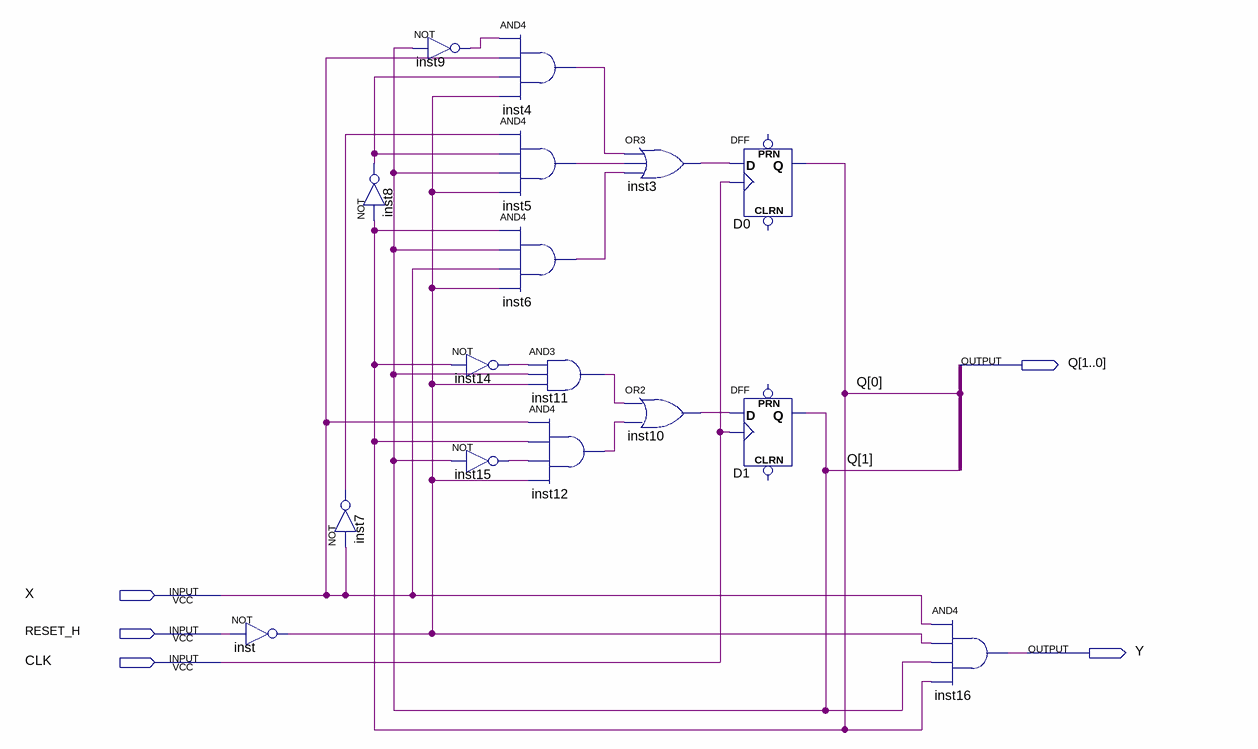
[diagram p0: schematic sheet]
// Quartus schematic MEF.bdf as structural Verilog: 16 symbols, 5 pins
module MEF (
  input  X,
  input  RESET_H,
  input  CLK,
  output [1:0] Q,
  output Y
);

  wire inst3_out, inst4_out, inst5_out, inst6_out, inst7_out, inst8_out, inst9_out, inst10_out, inst11_out,
       inst12_out, inst14_out, inst15_out, inst_out;

  not inst (inst_out, RESET_H);
  not inst8 (inst8_out, Q[0]);
  not inst7 (inst7_out, X);
  not inst9 (inst9_out, Q[1]);
  and inst4 (inst4_out, inst9_out, X, inst8_out, inst_out);
  and inst5 (inst5_out, inst7_out, inst8_out, Q[1], inst_out);
  and inst6 (inst6_out, Q[0], Q[1], X, inst_out);
  not inst14 (inst14_out, Q[0]);
  not inst15 (inst15_out, Q[1]);
  and inst11 (inst11_out, inst14_out, Q[1], inst_out);
  and inst12 (inst12_out, X, Q[0], inst15_out, inst_out);
  or inst3 (inst3_out, inst4_out, inst5_out, inst6_out);
  or inst10 (inst10_out, inst11_out, inst12_out);
  DFF D0 (.CLK(CLK), .D(inst3_out), .Q(Q[0]));  // open: CLRN, PRN
  DFF D1 (.CLK(CLK), .D(inst10_out), .Q(Q[1]));  // open: CLRN, PRN
  and inst16 (Y, X, inst_out, Q[1], Q[0]);
endmodule
